# Altium project piezocontroller.PrjPCB
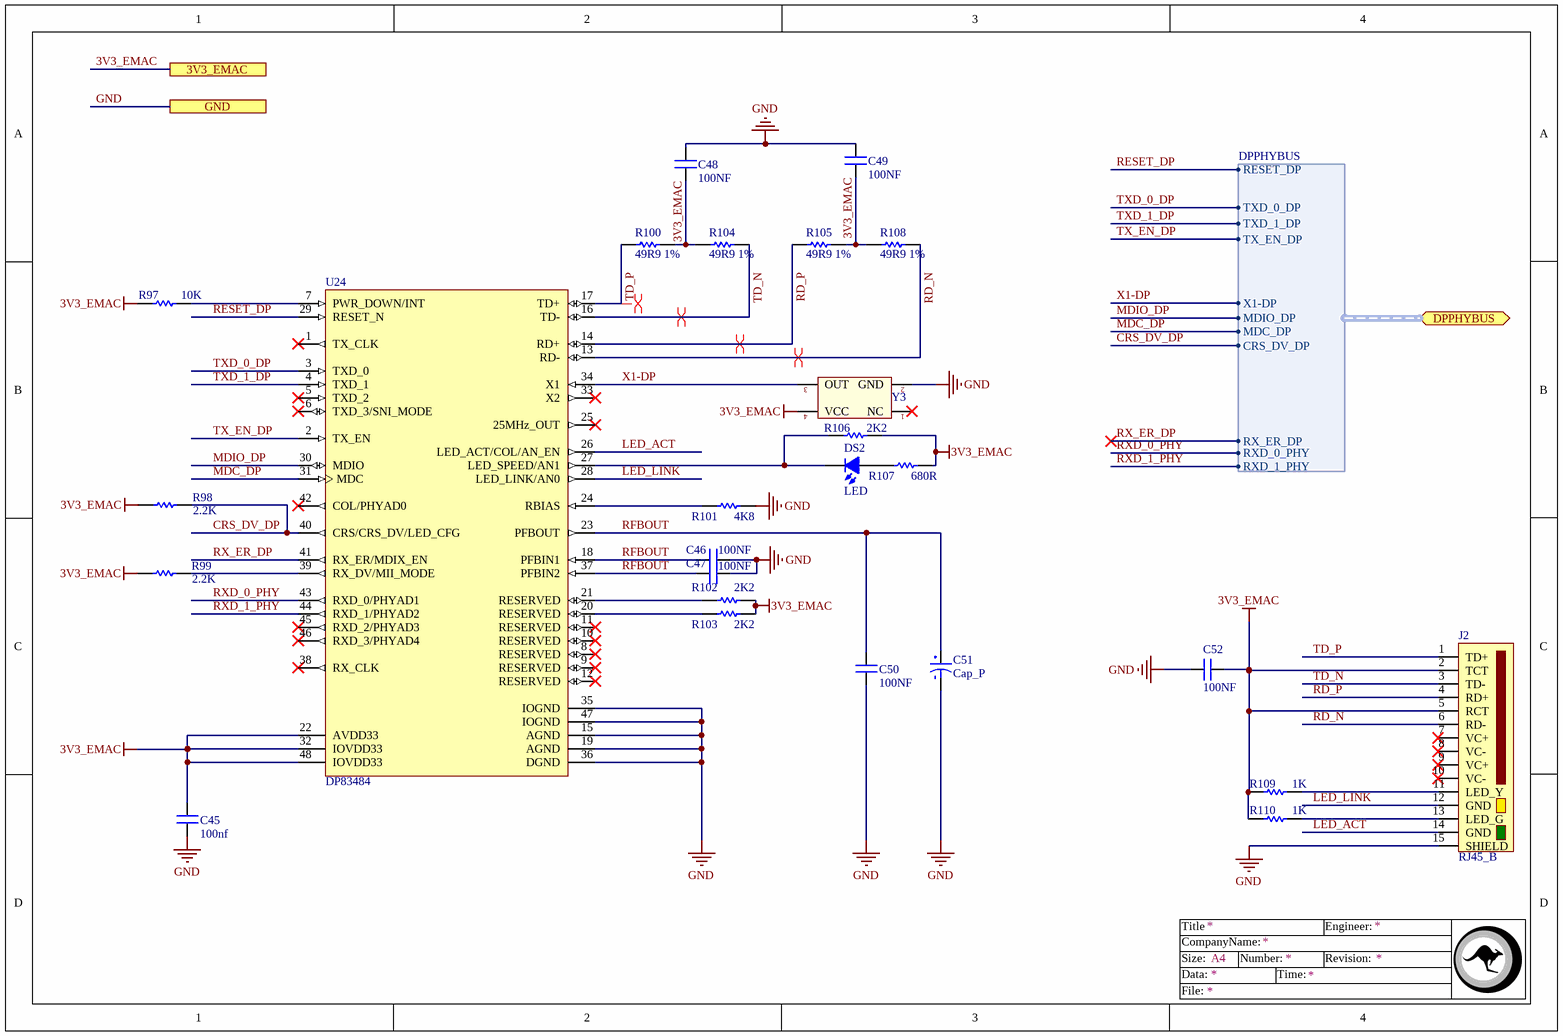
[diagram p0: Communication Ethernet DP.SchDoc]
5 sheets, 259 parts. Net scope: flat (ports and power ports of the same name join across sheets).
Board file: piezocontroller.PcbDoc
Sheets:
  Communication Ethernet DP.SchDoc
  Analogue.SchDoc
  Communication USB - FT232.SchDoc
  Power Management.SchDoc
  MicroControllerSTM32f107VCT.SchDoc

## Sheet Communication Ethernet DP.SchDoc
size A4

### Parts
C45  100nf  [Cap0805]
C46  100NF  [Cap0805]
C47  100NF  [Cap0805]
C48  100NF  [Cap0805]
C49  100NF  [Cap0805]
C50  100NF  [Cap0805]
C51  Cap_P  [Cap_4mm]
C52  100NF  [Cap0805]
DS2  LED  [Led0805]
J2  RJ45_B  [RJ45_B]
R97  10K  [R0805]
R98  2.2K  [R0805]
R99  2.2K  [R0805]
R100  49R9 1%  [R0805]
R101  4K8  [R0805]
R102  2K2  [R0805]
R103  2K2  [R0805]
R104  49R9 1%  [R0805]
R105  49R9 1%  [R0805]
R106  2K2  [R0805]
R107  680R  [R0805]
R108  49R9 1%  [R0805]
R109  1K  [R0805]
R110  1K  [R0805]
U24  DP83484  [DP83484]
Y3  Oscillator  [Crystall 50Mhz]  (value not drawn)

### Ports
3V3_EMAC, DPPHYBUS (bidir, harness DPPHYBUS), GND

### Harnesses
DPPHYBUS: RESET_DP, TXD_0_DP, X1-DP, TXD_1_DP, TX_EN_DP, MDIO_DP, MDC_DP, CRS_DV_DP, RX_ER_DP, RXD_0_PHY, RXD_1_PHY

### Nets
3V3_EMAC: C45.2 C48.1 C49.1 C52.1 J2.2(TCT) J2.5(RCT) R97.2 R98.2 R99.2 R100.2 R102.1 R103.1 R104.1 R105.2 R106.1 R107.1 R108.1 R109.1 R110.1 U24.22(AVDD33) U24.32(IOVDD33) U24.48(IOVDD33) Y3.4(VCC) ; port 3V3_EMAC
GND: C45.1 C46.2 C47.2 C48.2 C49.2 C50.1 C51.1 C52.2 J2.15(SHIELD) R101.1 U24.15(AGND) U24.19(AGND) U24.35(IOGND) U24.36(DGND) U24.47(IOGND) Y3.2(GND) ; port GND  [project net -12VD]
CRS_DV_DP: R98.1 U24.40(CRS/CRS_DV/LED_CFG) ; port DPPHYBUS.CRS_DV_DP
LED_ACT: J2.14(GND) U24.26(LED_ACT/COL/AN_EN)
LED_LINK: J2.12(GND) U24.28(LED_LINK/AN0)
MDC_DP: U24.31(MDC) ; port DPPHYBUS.MDC_DP  [project net ETH-MDC]
MDIO_DP: U24.30(MDIO) ; port DPPHYBUS.MDIO_DP  [project net ETH-MDIO]
RD_N: J2.6(RD-) R108.2 U24.13(RD-)
RD_P: J2.4(RD+) R105.1 U24.14(RD+)
RESET_DP: U24.29(RESET_N) ; port DPPHYBUS.RESET_DP  [project net NRST]
RFBOUT: C46.1 C47.1 C50.2 C51.2 U24.18(PFBIN1) U24.23(PFBOUT) U24.37(PFBIN2)
RX_ER_DP: U24.41(RX_ER/MDIX_EN) ; port DPPHYBUS.RX_ER_DP
RXD_0_PHY: U24.43(RXD_0/PHYAD1) ; port DPPHYBUS.RXD_0_PHY  [project net ETH-RXD0]
RXD_1_PHY: U24.44(RXD_1/PHYAD2) ; port DPPHYBUS.RXD_1_PHY  [project net ETH-RXD1]
TD_N: J2.3(TD-) R104.2 U24.16(TD-)
TD_P: J2.1(TD+) R100.1 U24.17(TD+)
TX_EN_DP: U24.2(TX_EN) ; port DPPHYBUS.TX_EN_DP  [project net ETH-TX-EN]
TXD_0_DP: U24.3(TXD_0) ; port DPPHYBUS.TXD_0_DP  [project net ETH-TXD0]
TXD_1_DP: U24.4(TXD_1) ; port DPPHYBUS.TXD_1_DP  [project net ETH-TXD1]
X1-DP: U24.34(X1) Y3.3(OUT) ; port DPPHYBUS.X1-DP  [project net ETH-REF-CLK]
NetDS2_A: DS2.A R107.2
NetDS2_K: DS2.K R106.2 U24.27(LED_SPEED/AN1)
NetJ2_11: J2.11(LED_Y) R109.2
NetJ2_13: J2.13(LED_G) R110.2
NetR97_1: R97.1 U24.7(PWR_DOWN/INT)
NetR99_1: R99.1 U24.39(RX_DV/MII_MODE)
NetR101_2: R101.2 U24.24(RBIAS)
NetR102_2: R102.2 U24.21(RESERVED)
NetR103_2: R103.2 U24.20(RESERVED)

Not connected (* = marked no-connect by the designer): J2 7(VC+)* 8(VC-)* 9(VC+)* 10(VC-)*; U24 1(TX_CLK)* 5(TXD_2)* 6(TXD_3/SNI_MODE)* 8(RESERVED)* 9(RESERVED)* 10(RESERVED)* 11(RESERVED)* 12(RESERVED)* 25(25MHz_OUT)* 33(X2)* 38(RX_CLK)* 42(COL/PHYAD0)* 45(RXD_2/PHYAD3)* 46(RXD_3/PHYAD4)*; Y3 1(NC)*

### Layout directives
differential pair: RD_N, RD_P, TD_N, TD_P

### Notes on the sheet
- Title
- Size:
- Data:
- CompanyName:
- A4
- Number:
- Time:
- Revision:
- Engineer:
- File:

### Library data of the parts
C45-C50 C52 = Cap: Surface mount Capacitor
C51 = Cap_P: Polarity
J2 = RJ45_B: Ethernet Connector
R97-R110 = Resistor
U24 = DP83484: Ethernet PHY

## Sheet Analogue.SchDoc
size A3
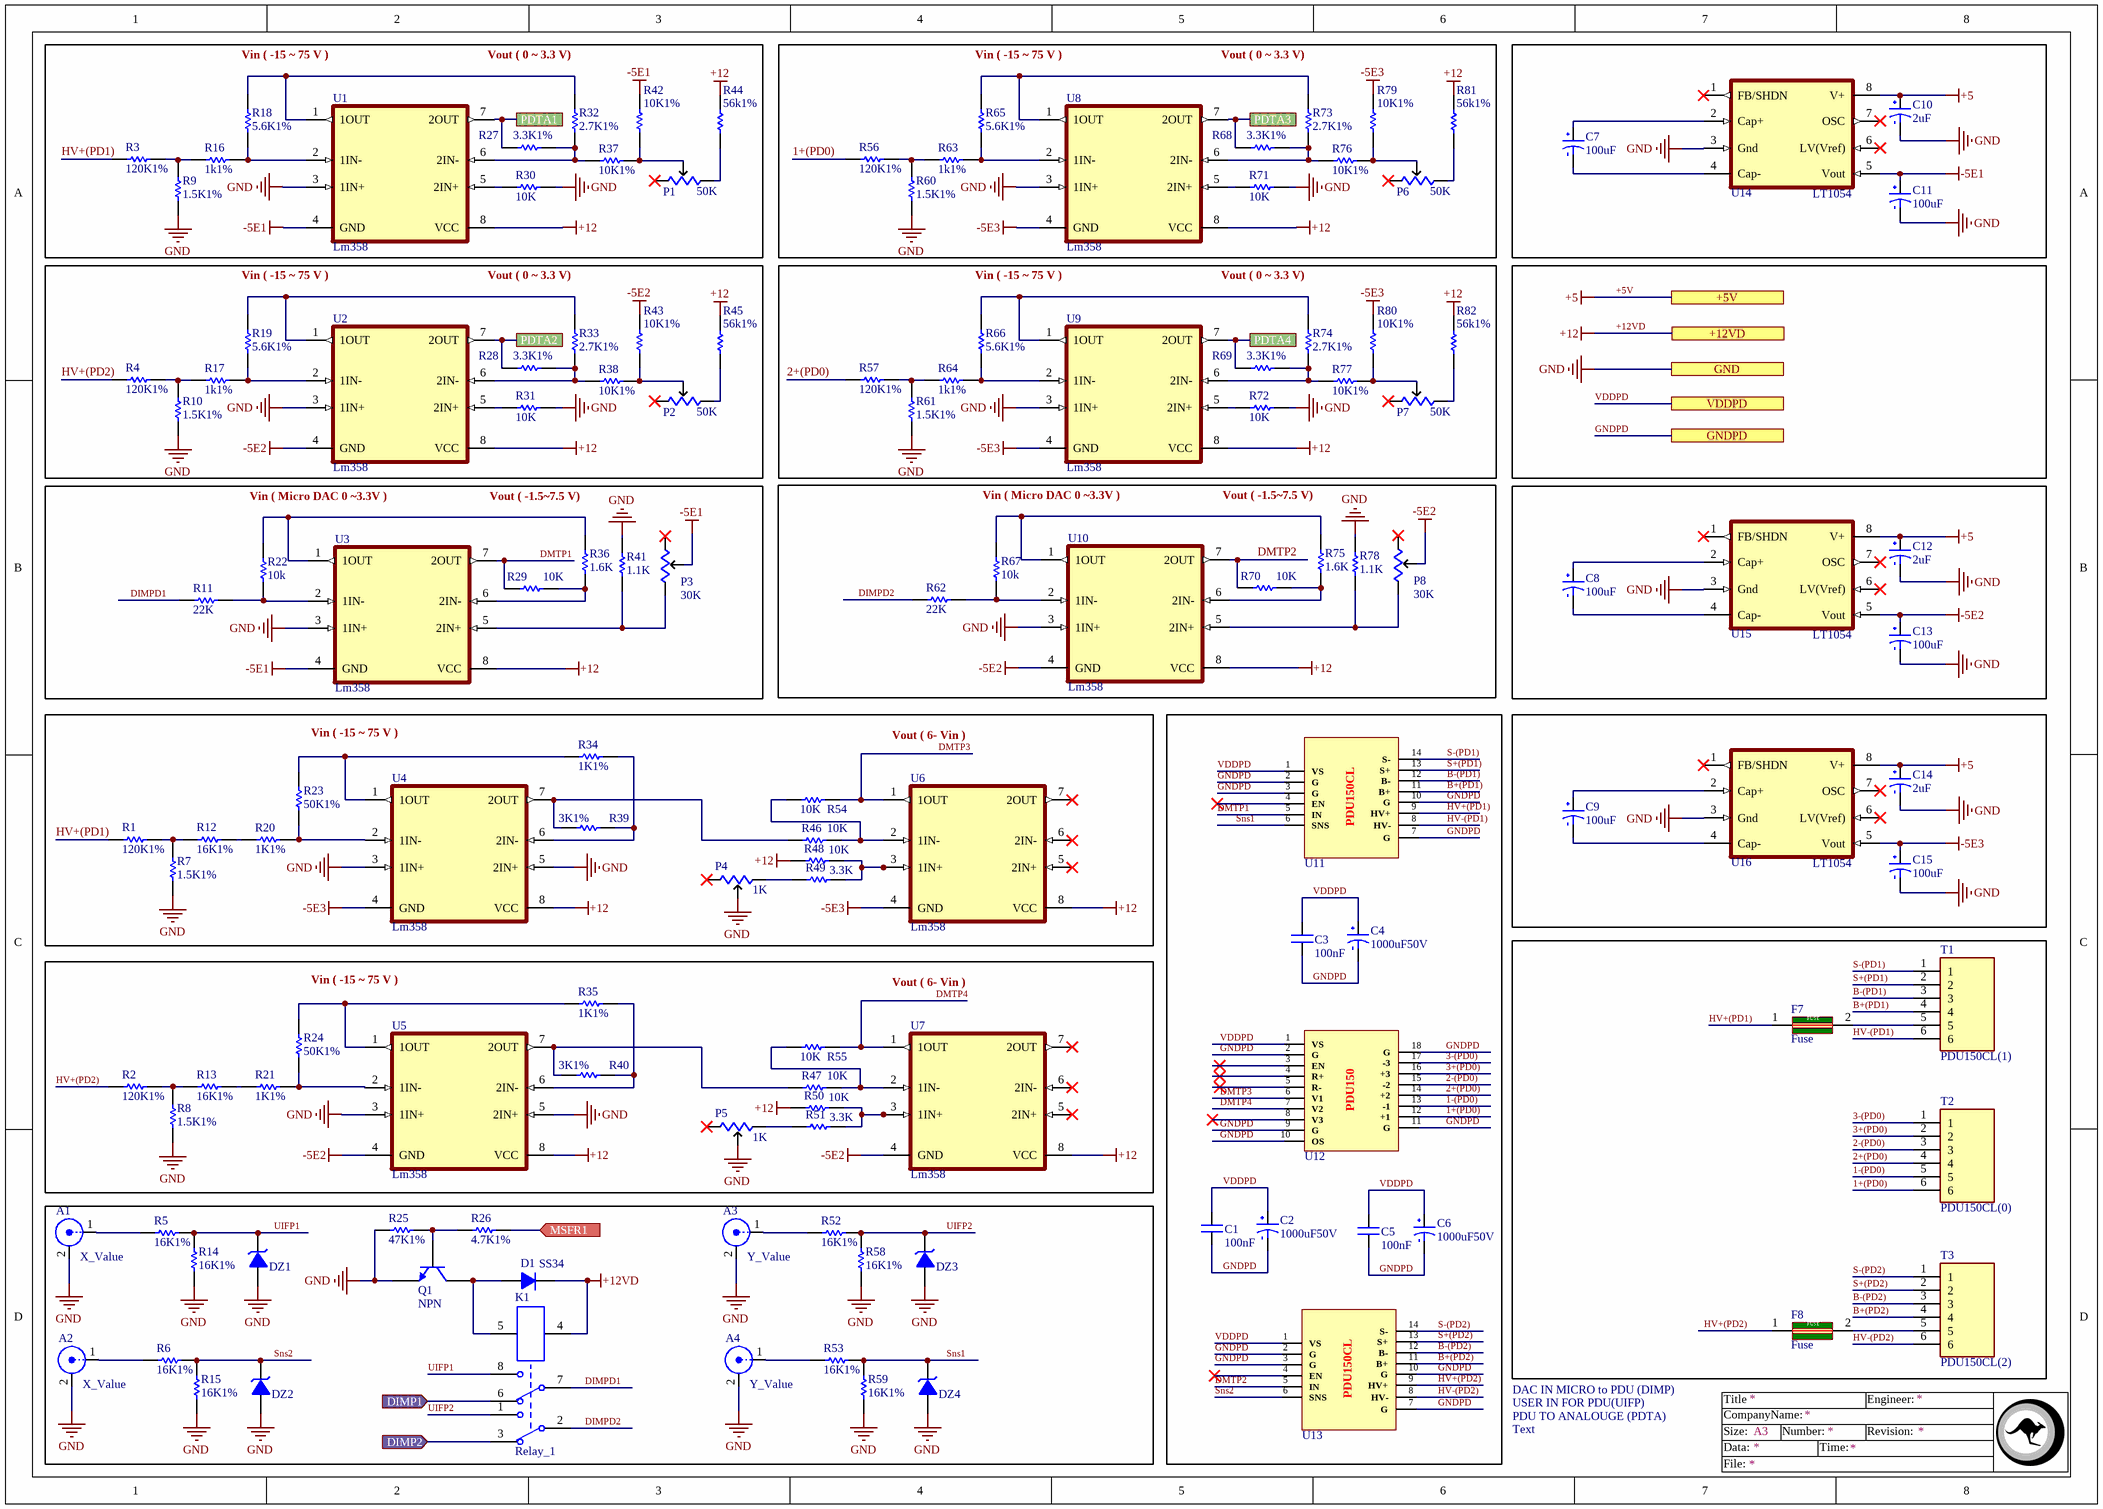
[diagram p1: Analogue.SchDoc]

### Parts
A1  X_Value  [SMA - R]
A2  X_Value  [SMA - R]
A3  Y_Value  [SMA - R]
A4  Y_Value  [SMA - R]
C1  100nF  [Cap0805]
C2  1000uF50V  [Cap_5mm]
C3  100nF  [Cap0805]
C4  1000uF50V  [Cap_5mm]
C5  100nF  [Cap0805]
C6  1000uF50V  [Cap_5mm]
C7  100uF  [CAPMOL_D]
C8  100uF  [CAPMOL_D]
C9  100uF  [CAPMOL_D]
C10  2uF  [CAPMOL_B]
C11  100uF  [CAPMOL_D]
C12  2uF  [CAPMOL_B]
C13  100uF  [CAPMOL_D]
C14  2uF  [CAPMOL_B]
C15  100uF  [CAPMOL_D]
D1  SS34  [Diod-1A-SMD]
DZ1  Diode Zener  [LL4148]  (value not drawn)
DZ2  Diode Zener  [LL4148]  (value not drawn)
DZ3  Diode Zener  [LL4148]  (value not drawn)
DZ4  Diode Zener  [LL4148]  (value not drawn)
F7  Fuse  [1206]
F8  Fuse  [1206]
K1  Relay_1  [Relay_1]
P1  50K  [Multi_tern]
P2  50K  [Multi_tern]
P3  30K  [Multi_tern]
P4  1K  [Multi_tern]
P5  1K  [Multi_tern]
P6  50K  [Multi_tern]
P7  50K  [Multi_tern]
P8  30K  [Multi_tern]
Q1  NPN  [SOT23_BEC_N]
R1  120K1%  [R0805]
R2  120K1%  [R0805]
R3  120K1%  [R0805]
R4  120K1%  [R0805]
R5  16K1%  [R0805]
R6  16K1%  [R0805]
R7  1.5K1%  [R0805]
R8  1.5K1%  [R0805]
R9  1.5K1%  [R0805]
R10  1.5K1%  [R0805]
R11  22K  [R0805]
R12  16K1%  [R0805]
R13  16K1%  [R0805]
R14  16K1%  [R0805]
R15  16K1%  [R0805]
R16  1k1%  [R0805]
R17  1k1%  [R0805]
R18  5.6K1%  [R0805]
R19  5.6K1%  [R0805]
R20  1K1%  [R0805]
R21  1K1%  [R0805]
R22  10k  [R0805]
R23  50K1%  [R0805]
R24  50K1%  [R0805]
R25  47K1%  [R0805]
R26  4.7K1%  [R0805]
R27  3.3K1%  [R0805]
R28  3.3K1%  [R0805]
R29  10K  [R0805]
R30  10K  [R0805]
R31  10K  [R0805]
R32  2.7K1%  [R0805]
R33  2.7K1%  [R0805]
R34  1K1%  [R0805]
R35  1K1%  [R0805]
R36  1.6K  [R0805]
R37  10K1%  [R0805]
R38  10K1%  [R0805]
R39  3K1%  [R0805]
R40  3K1%  [R0805]
R41  1.1K  [R0805]
R42  10K1%  [R0805]
R43  10K1%  [R0805]
R44  56k1%  [R0805]
R45  56k1%  [R0805]
R46  10K  [R0805]
R47  10K  [R0805]
R48  10K  [R0805]
R49  3.3K  [R0805]
R50  10K  [R0805]
R51  3.3K  [R0805]
R52  16K1%  [R0805]
R53  16K1%  [R0805]
R54  10K  [R0805]
R55  10K  [R0805]
R56  120K1%  [R0805]
R57  120K1%  [R0805]
R58  16K1%  [R0805]
R59  16K1%  [R0805]
R60  1.5K1%  [R0805]
R61  1.5K1%  [R0805]
R62  22K  [R0805]
R63  1k1%  [R0805]
R64  1k1%  [R0805]
R65  5.6K1%  [R0805]
R66  5.6K1%  [R0805]
R67  10k  [R0805]
R68  3.3K1%  [R0805]
R69  3.3K1%  [R0805]
R70  10K  [R0805]
R71  10K  [R0805]
R72  10K  [R0805]
R73  2.7K1%  [R0805]
R74  2.7K1%  [R0805]
R75  1.6K  [R0805]
R76  10K1%  [R0805]
R77  10K1%  [R0805]
R78  1.1K  [R0805]
R79  10K1%  [R0805]
R80  10K1%  [R0805]
R81  56k1%  [R0805]
R82  56k1%  [R0805]
T1  PDU150CL(1)  [SPOX6]
T2  PDU150CL(0)  [SPOX6]
T3  PDU150CL(2)  [SPOX6]
U1  Lm358  [SOIC127P600X175-8N]
U2  Lm358  [SOIC127P600X175-8N]
U3  Lm358  [SOIC127P600X175-8N]
U4  Lm358  [SOIC127P600X175-8N]
U5  Lm358  [SOIC127P600X175-8N]
U6  Lm358  [SOIC127P600X175-8N]
U7  Lm358  [SOIC127P600X175-8N]
U8  Lm358  [SOIC127P600X175-8N]
U9  Lm358  [SOIC127P600X175-8N]
U10  Lm358  [SOIC127P600X175-8N]
U11  PDU150CL  [PDU150CL]  (value not drawn)
U12  PDU150  [PDU150]  (value not drawn)
U13  PDU150CL  [PDU150CL]  (value not drawn)
U14  LT1054  [SOIC127P600X175-8N]
U15  LT1054  [SOIC127P600X175-8N]
U16  LT1054  [SOIC127P600X175-8N]

### Ports
+5V, +12VD, DIMP1 (in), DIMP2 (in), GND, GNDPD, MSFR1 (in), PDTA1, PDTA2, PDTA3, PDTA4, VDDPD

### Nets
+5V: C10.2 C12.2 C14.2 U14.8(V+) U15.8(V+) U16.8(V+) ; port +5V  [also labelled +5]
+12: D1.K K1.4 R44.1 R45.1 R48.1 R50.1 R81.1 R82.1 U1.8(VCC) U2.8(VCC) U3.8(VCC) U4.8(VCC) U5.8(VCC) U6.8(VCC) U7.8(VCC) U8.8(VCC) U9.8(VCC) U10.8(VCC) ; port +12VD  [also labelled +12VD]  [project net +12V]
-5E1: C11.2 P3.2 R42.1 U1.4(GND) U3.4(GND) U14.5(Vout)
-5E2: C13.2 P8.2 R43.1 U2.4(GND) U5.4(GND) U7.4(GND) U10.4(GND) U15.5(Vout)
-5E3: C15.2 R79.1 R80.1 U4.4(GND) U6.4(GND) U8.4(GND) U9.4(GND) U16.5(Vout)
GND: A1.2(Y) A2.2(Y) A3.2(Y) A4.2(Y) C10.1 C11.1 C12.1 C13.1 C14.1 C15.1 DZ1.A DZ2.A DZ3.A DZ4.A P4.2 P5.2 Q1.2(E) R7.1 R8.1 R9.1 R10.1 R14.1 R15.1 R25.2 R30.1 R31.1 R41.1 R58.1 R59.1 R60.1 R61.1 R71.1 R72.1 R78.1 U1.3(1IN+) U2.3(1IN+) U3.3(1IN+) U4.3(1IN+) U4.5(2IN+) U5.3(1IN+) U5.5(2IN+) U8.3(1IN+) U9.3(1IN+) U10.3(1IN+) U14.3(Gnd) U15.3(Gnd) U16.3(Gnd) ; port GND  [project net -12VD]
1+(PD0): R56.2 T2.6 U12.12(+1)
1-(PD0): T2.5 U12.13(-1)
2+(PD0): R57.2 T2.4 U12.14(+2)
2-(PD0): T2.3 U12.15(-2)
3+(PD0): T2.2 U12.16(+3)
3-(PD0): T2.1 U12.17(-3)
B+(PD1): T1.4 U11.11(B+)
B+(PD2): T3.4 U13.11(B+)
B-(PD1): T1.3 U11.12(B-)
B-(PD2): T3.3 U13.12(B-)
DIMPD1: K1.7 R11.1
DIMPD2: K1.2 R62.1
DMTP1: R29.1 U3.7(2OUT) U11.5(IN)
DMTP2: R70.1 U10.7(2OUT) U13.5(IN)
DMTP3: R54.2 U6.1(1OUT) U12.6(V1)
DMTP4: R55.2 U7.1(1OUT) U12.7(V2)
GNDPD: C1.1 C2.1 C3.1 C4.1 C5.1 C6.1 U11.2(G) U11.3(G) U11.7(G) U11.10(G) U12.2(G) U12.9(G) U12.10(OS) U12.11(G) U12.18(G) U13.2(G) U13.3(G) U13.7(G) U13.10(G) ; port GNDPD
HV+(PD1): F7.1(IN) R1.1 R3.2 U11.9(HV+)
HV+(PD2): F8.1(IN) R2.1 R4.2 U13.9(HV+)
HV-(PD1): T1.6 U11.8(HV-)
HV-(PD2): T3.6 U13.8(HV-)
S+(PD1): T1.2 U11.13(S+)
S+(PD2): T3.2 U13.13(S+)
S-(PD1): T1.1 U11.14(S-)
S-(PD2): T3.1 U13.14(S-)
Sns1: DZ4.K R53.2 R59.2 U11.6(SNS)
Sns2: DZ2.K R6.2 R15.2 U13.6(SNS)
UIFP1: DZ1.K K1.8 R5.2 R14.2
UIFP2: DZ3.K K1.1 R52.2 R58.2
VDDPD: C1.2 C2.2 C3.2 C4.2 C5.2 C6.2 U11.1(VS) U12.1(VS) U13.1(VS) ; port VDDPD
NetA1_1: A1.1(X) R5.1
NetA2_1: A2.1(X) R6.1
NetA3_1: A3.1(X) R52.1
NetA4_1: A4.1(X) R53.1
NetC7_1: C7.1 U14.4(Cap-)
NetC7_2: C7.2 U14.2(Cap+)
NetC8_1: C8.1 U15.4(Cap-)
NetC8_2: C8.2 U15.2(Cap+)
NetC9_1: C9.1 U16.4(Cap-)
NetC9_2: C9.2 U16.2(Cap+)
NetD1_A: D1.A K1.5 Q1.3(C)
NetF7_2: F7.2(OUT) T1.5
NetF8_2: F8.2(OUT) T3.5
NetK1_3: K1.3 ; port DIMP2
NetK1_6: K1.6 ; port DIMP1
NetP1_2: P1.2 R37.1 R42.2
NetP1_3: P1.3 R44.2
NetP2_2: P2.2 R38.1 R43.2
NetP2_3: P2.3 R45.2
NetP3_3: P3.3 R41.2 U3.5(2IN+)
NetP4_1: P4.1 R49.1
NetP5_1: P5.1 R51.1
NetP6_2: P6.2 R76.1 R79.2
NetP6_3: P6.3 R81.2
NetP7_2: P7.2 R77.1 R80.2
NetP7_3: P7.3 R82.2
NetP8_3: P8.3 R78.2 U10.5(2IN+)
NetQ1_1: Q1.1(B) R25.1 R26.2
NetR1_2: R1.2 R7.2 R12.1
NetR2_2: R2.2 R8.2 R13.1
NetR3_1: R3.1 R9.2 R16.1
NetR4_1: R4.1 R10.2 R17.1
NetR11_2: R11.2 R22.2 U3.2(1IN-)
NetR12_2: R12.2 R20.1
NetR13_2: R13.2 R21.1
NetR16_2: R16.2 R18.2 U1.2(1IN-)
NetR17_2: R17.2 R19.2 U2.2(1IN-)
NetR18_1: R18.1 R32.1 U1.1(1OUT)
NetR19_1: R19.1 R33.1 U2.1(1OUT)
NetR20_2: R20.2 R23.2 U4.2(1IN-)
NetR21_2: R21.2 R24.2 U5.2(1IN-)
NetR22_1: R22.1 R36.1 U3.1(1OUT)
NetR23_1: R23.1 R34.1 U4.1(1OUT)
NetR24_1: R24.1 R35.1 U5.1(1OUT)
NetR26_1: R26.1 ; port MSFR1
NetR27_1: R27.1 U1.7(2OUT) ; port PDTA1
NetR27_2: R27.2 R32.2 R37.2 U1.6(2IN-)
NetR28_1: R28.1 U2.7(2OUT) ; port PDTA2
NetR28_2: R28.2 R33.2 R38.2 U2.6(2IN-)
NetR29_2: R29.2 R36.2 U3.6(2IN-)
NetR30_2: R30.2 U1.5(2IN+)
NetR31_2: R31.2 U2.5(2IN+)
NetR34_2: R34.2 R39.2 U4.6(2IN-)
NetR35_2: R35.2 R40.2 U5.6(2IN-)
NetR39_1: R39.1 R46.1 U4.7(2OUT)
NetR40_1: R40.1 R47.1 U5.7(2OUT)
NetR46_2: R46.2 R54.1 U6.2(1IN-)
NetR47_2: R47.2 R55.1 U7.2(1IN-)
NetR48_2: R48.2 R49.2 U6.3(1IN+)
NetR50_2: R50.2 R51.2 U7.3(1IN+)
NetR56_1: R56.1 R60.2 R63.1
NetR57_1: R57.1 R61.2 R64.1
NetR62_2: R62.2 R67.2 U10.2(1IN-)
NetR63_2: R63.2 R65.2 U8.2(1IN-)
NetR64_2: R64.2 R66.2 U9.2(1IN-)
NetR65_1: R65.1 R73.1 U8.1(1OUT)
NetR66_1: R66.1 R74.1 U9.1(1OUT)
NetR67_1: R67.1 R75.1 U10.1(1OUT)
NetR68_1: R68.1 U8.7(2OUT) ; port PDTA3
NetR68_2: R68.2 R73.2 R76.2 U8.6(2IN-)
NetR69_1: R69.1 U9.7(2OUT) ; port PDTA4
NetR69_2: R69.2 R74.2 R77.2 U9.6(2IN-)
NetR70_2: R70.2 R75.2 U10.6(2IN-)
NetR71_2: R71.2 U8.5(2IN+)
NetR72_2: R72.2 U9.5(2IN+)

Not connected (* = marked no-connect by the designer): P1 1*; P2 1*; P3 1*; P4 3*; P5 3*; P6 1*; P7 1*; P8 1*; U6 5(2IN+)* 6(2IN-)* 7(2OUT)*; U7 5(2IN+)* 6(2IN-)* 7(2OUT)*; U11 4(EN)*; U12 3(EN)* 4(R+)* 5(R-)* 8(V3)*; U13 4(EN)*; U14 1(FB/SHDN)* 6(LV(Vref))* 7(OSC)*; U15 1(FB/SHDN)* 6(LV(Vref))* 7(OSC)*; U16 1(FB/SHDN)* 6(LV(Vref))* 7(OSC)*

### Notes on the sheet
- Vin ( -15 ~ 75 V )
- Vout ( 0 ~ 3.3 V)
- Vin ( Micro DAC 0 ~3.3V )
- Vout ( -1.5~7.5 V)
- Vout ( 6- Vin )
- DAC IN MICRO to PDU (DIMP)
- USER IN FOR PDU(UIFP)
- PDU TO ANALOUGE (PDTA)
- Text
- Title
- Size:
- Data:
- CompanyName:
- A3
- Number:
- Time:
- Revision:
- Engineer:
- File:
- (in symbol Fuse) FUSE

### Library data of the parts
A1-A4 = ANTENA: Antena MLF
C1 C3 C5 = Cap: Surface mount Capacitor
C2 C4 C6-C15 = Cap_P: Polarity
D1 = Diode
K1 = Relay_1: Relay
P1-P8 = POT: Potentiometer
Q1 = NPN: NPN Bipolar Transistor; Published: 8-Jun-2000; LatestRevisionDate: 29-May-2009; LatestRevisionNote: IPC-7351 Footprint Added.; PackageVersion: Aug-1999; PackageReference: SOT-23B; Publisher: Altium Limited; PackageDescription: 3-Pin SOT-23 Package 0.95 mm Pitch, 2.4 mm Lead Span
R1-R17 R20 R21 R25 R26 R52 R53 R56-R64 = Resistor: 30K
R18 R19 R22-R24 R27-R51 R54 R55 R65-R82 = Resistor
T1-T3 = SPOX 1*6
U14-U16 = LMC7660

## Sheet Communication USB - FT232.SchDoc
size A4
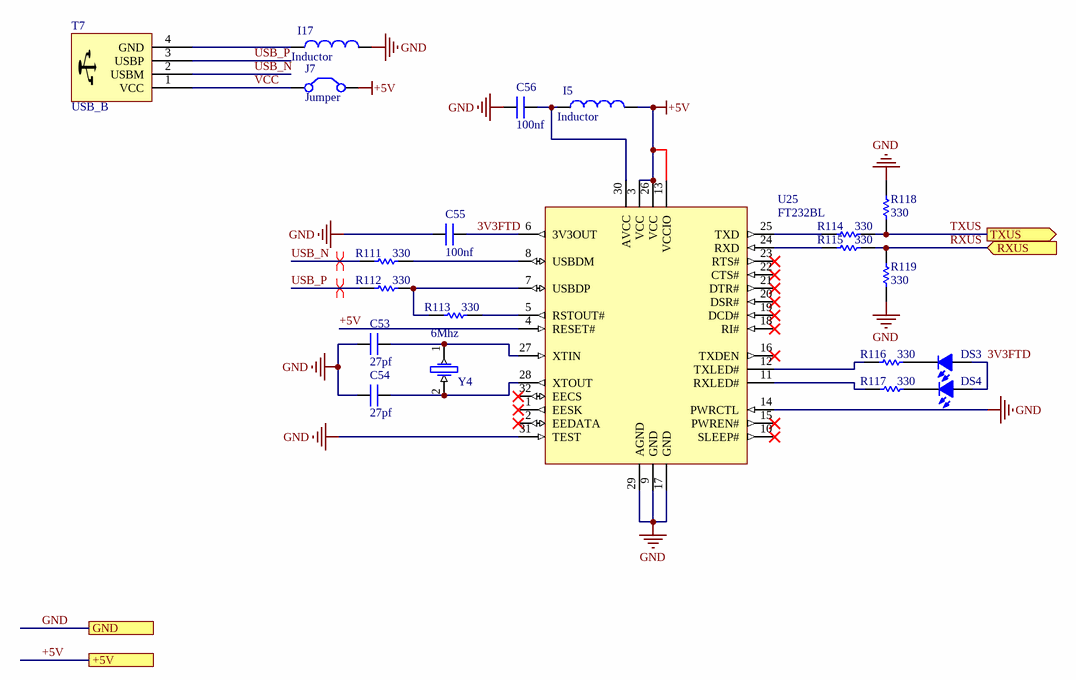
[diagram p2: Communication USB - FT232.SchDoc]

### Parts
C53  27pf  [Cap0805]
C54  27pf  [Cap0805]
C55  100nf  [Cap0805]
C56  100nf  [Cap0805]
DS3  LED  [Led0805]  (value not drawn)
DS4  LED  [Led0805]  (value not drawn)
I5  Inductor  [1206]
I17  Inductor  [1206]
J7  Jumper  [Jumper]
R111  330  [R0805]
R112  330  [R0805]
R113  330  [R0805]
R114  330  [R0805]
R115  330  [R0805]
R116  330  [R0805]
R117  330  [R0805]
R118  330  [R0805]
R119  330  [R0805]
T7  USB_B  [USB_Dip_R]
U25  FT232BL  [LQFP-32_L]
Y4  6Mhz  [CrystallB]

### Ports
+5V, GND, RXUS (in), TXUS (out)

### Nets
+5V: I5.2 J7.2(C2) U25.3(VCC) U25.4(RESET#) U25.13(VCCIO) U25.26(VCC) ; port +5V
GND: C53.1 C54.1 C55.2 C56.2 I17.2 R118.2 R119.1 U25.9(GND) U25.14(PWRCTL) U25.17(GND) U25.29(AGND) U25.31(TEST) ; port GND  [project net -12VD]
3V3FTD: C55.1 DS3.A DS4.A U25.6(3V3OUT)
RXUS: R115.2 R119.2 ; port RXUS
TXUS: R114.2 R118.1 ; port TXUS
USB_N: R111.1 T7.2(USBM)
USB_P: R112.1 T7.3(USBP)
VCC: J7.1(C1) T7.1(VCC)
NetC53_2: C53.2 U25.27(XTIN) Y4.1
NetC54_2: C54.2 U25.28(XTOUT) Y4.2
NetC56_1: C56.1 I5.1 U25.30(AVCC)
NetDS3_K: DS3.K R116.2
NetDS4_K: DS4.K R117.2
NetI17_1: I17.1 T7.4(GND)
NetR111_2: R111.2 U25.8(USBDM)
NetR112_2: R112.2 R113.1 U25.7(USBDP)
NetR113_2: R113.2 U25.5(RSTOUT#)
NetR114_1: R114.1 U25.25(TXD)
NetR115_1: R115.1 U25.24(RXD)
NetR116_1: R116.1 U25.12(TXLED#)
NetR117_1: R117.1 U25.11(RXLED#)

Not connected (* = marked no-connect by the designer): U25 1(EESK)* 2(EEDATA)* 10(SLEEP#)* 15(PWREN#)* 16(TXDEN)* 18(RI#)* 19(DCD#)* 20(DSR#)* 21(DTR#)* 22(CTS#)* 23(RTS#)* 32(EECS)*

### Layout directives
differential pair: USB_N, USB_P

### Notes on the sheet
- Title
- Size:
- Data:
- CompanyName:
- A4
- Number:
- Time:
- Revision:
- Engineer:
- File:

### Library data of the parts
C53-C56 = Cap: Surface mount Capacitor
I5 I17 = Inductor: Indicator
R111-R119 = Resistor
T7 = USB_B: USB B Connector
U25 = FT232BL: USB UART Asynchronous Serial Data Transfer Chip, LQFP-32, Pb-Free; DatasheetVersion: ver 2.2, Nov-2011; PackageVersion: 2010; PackageReference: LQFP-32; PackageDescription: 32-Pin Thin Quad Flat Pack 0.8 mm Pitch; ComponentLink1Description: Manufacturer URL; ComponentLink1URL: http://www.ftdichip.com/; ComponentLink2Description: Datasheet; ComponentLink2URL: http://www.ftdichip.com/Support/Documents/DataSheets/ICs/DS_FT232BL_BQ.pdf
Y4 = Crystal

## Sheet Power Management.SchDoc
size A4
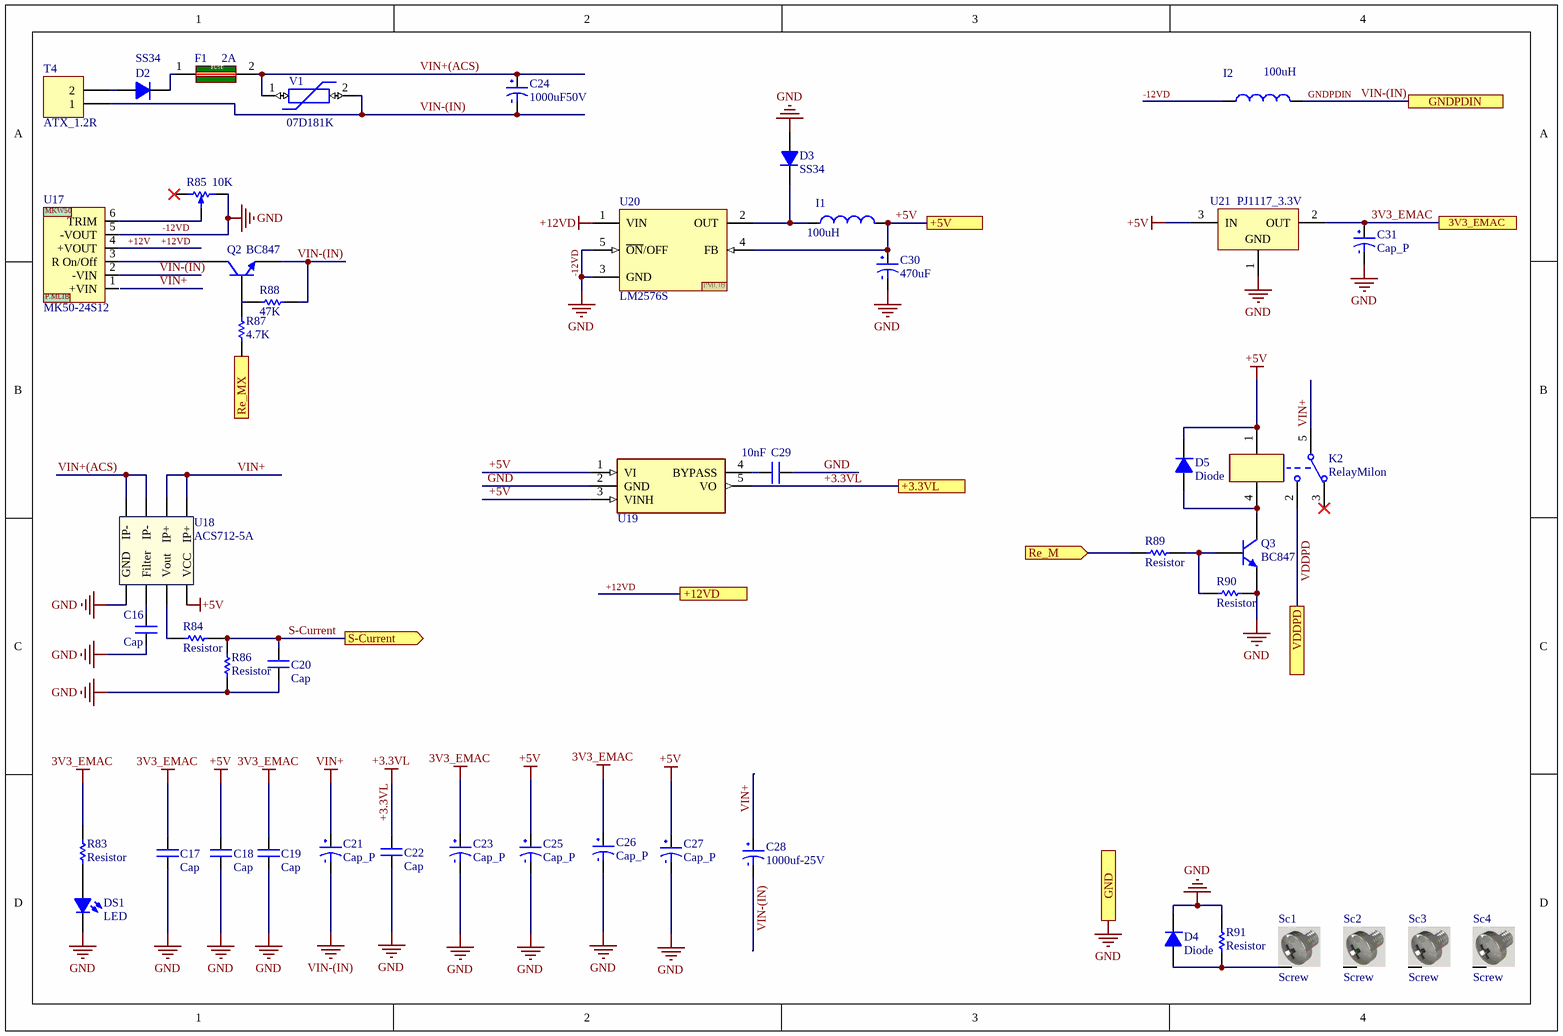
[diagram p3: Power Management.SchDoc]

### Parts
C16  Cap  [Cap0805]
C17  Cap  [Cap0805]
C18  Cap  [Cap0805]
C19  Cap  [Cap0805]
C20  Cap  [Cap0805]
C21  Cap_P  [Cap_5mm]
C22  Cap  [Cap0805]
C23  Cap_P  [CAPMOL_C]
C24  1000uF50V  [Cap_8mm]
C25  Cap_P  [CAPMOL_C]
C26  Cap_P  [CAPMOL_C]
C27  Cap_P  [Cap_SMD]
C28  1000uf-25V  [Cap_5mm]
C29  10nF  [Cap0805]
C30  470uF  [Cap_4mm]
C31  Cap_P  [Cap_4mm]
D2  SS34  [Diod-1A-SMD]
D3  SS34  [Diod-1A-SMD]
D4  Diode  [Diod-1A-SMD]
D5  Diode  [Diod-1A-SMD]
DS1  LED  [Led0805]
F1  2A  [1206]
I1  100uH  [Indicator_SMD]
I2  100uH  [Indicator_10mH]
K2  RelayMilon  [RelayMinionSmall]
Q2  BC847  [SOT23_BEC_L]
Q3  BC847  [SOT23_BEC_L]
R83  Resistor  [R0805]
R84  Resistor  [R0805]
R85  value 10K  [POT4MM-Small Pot]  (hidden comment: RPot SM)
R86  Resistor  [R0805]
R87  4.7K  [R0805]
R88  47K  [R0805]
R89  Resistor  [R0805]
R90  Resistor  [R0805]
R91  Resistor  [0603]
Sc1  Screw  [Screw]
Sc2  Screw  [Screw]
Sc3  Screw  [Screw]
Sc4  Screw  [Screw]
T4  ATX_1.2R  [ATX_1.2S]
U17  MK50-24S12  [MK50]
U18  ACS712-5A  [SOP8]
U19  LD3985M33R  [SOT95P280X110-5N]  (value not drawn)
U20  LM2576S  [LM2576S]
U21  PJ1117_3.3V  [PJ1117s]
V1  07D181K  [MOV-7D]

### Ports
3V3_EMAC, +3.3VL, +5V, +12VD, GND, GNDPDIN, Re_M (in), Re_MX (in), S-Current (out), VDDPD

### Nets
3V3_EMAC: C17.2 C19.2 C23.2 C26.2 C31.2 R83.1 U21.2(OUT) ; port 3V3_EMAC
+3.3VL: C22.2 U19.5(VO) ; port +3.3VL
+5V: C18.2 C25.2 C27.2 C30.2 D5.K I1.2 K2.1 U18.8(VCC) U19.1(VI) U19.3(VINH) U20.4(FB) U21.3(IN) ; port +5V
+12V: U17.4(+VOUT) U20.1(VIN) ; port +12VD  [also labelled +12VD]
-12VD: C16.1 C17.1 C18.1 C19.1 C20.1 C22.1 C23.1 C25.1 C26.1 C27.1 C29.2 C30.1 C31.1 D3.A D4.K DS1.K I2.1 Q3.2(E) R85.CW(+) R86.2 R90.1 R91.1 U17.5(-VOUT) U18.5(GND) U19.2(GND) U20.3(GND) U20.5(~{ON}/OFF) U21.1(GND) ; port GND  [also labelled GND]
GNDPDIN: C21.1 C24.1 C28.1 I2.2 Q2.2(E) R88.1 T4.1 U17.2(-VIN) V1.2 ; port GNDPDIN  [also labelled VIN-(IN)]
VIN+: C21.2 C28.2 K2.5 U18.1(IP+) U18.2(IP+)
S-Current: C20.2 R84.1 R86.1 ; port S-Current
VDDPD: K2.2 ; port VDDPD
VIN+(ACS): C24.2 F1.2(OUT) U18.3(IP-) U18.4(IP-) V1.1
NetC16_2: C16.2 U18.6(Filter)
NetC29_1: C29.1 U19.4(BYPASS)
NetD2_A: D2.A T4.2
NetD2_K: D2.K F1.1(IN)
NetD3_K: D3.K I1.1 U20.2(OUT)
NetD4_A: D4.A R91.2 Sc1.S
NetD5_A: D5.A K2.4 Q3.3(C)
NetDS1_A: DS1.A R83.2
NetQ2_1: Q2.1(B) R87.1 R88.2
NetQ2_3: Q2.3(C) U17.3(R_On/Off)
NetQ3_1: Q3.1(B) R89.1 R90.2
NetR84_2: R84.2 U18.7(Vout)
NetR85_W: R85.W U17.6(TRIM)
NetR87_2: R87.2 ; port Re_MX
NetR89_2: R89.2 ; port Re_M

Not connected (* = marked no-connect by the designer): K2 3*; R85 CCW(-)*; Sc2 S; Sc3 S; Sc4 S; U17 1(+VIN)

### Notes on the sheet
- Title
- Size:
- Data:
- CompanyName:
- A4
- Number:
- Time:
- Revision:
- Engineer:
- File:
- (in symbol Fuse) FUSE
- (in symbol LM2576S) PMLIB
- (in symbol MK50) MKW50; P.MLIB

### Library data of the parts
C16-C20 C22 C29 = Cap: Surface mount Capacitor
C21 C23-C28 C30 C31 = Cap_P: Polarity
D2 D3 = Diode
F1 = Fuse
I1 I2 = Inductor: Indicator
Q2 Q3 = NPN: NPN Bipolar Transistor; Published: 8-Jun-2000; LatestRevisionDate: 29-May-2009; LatestRevisionNote: IPC-7351 Footprint Added.; PackageVersion: Aug-1999; PackageReference: SOT-23B; Publisher: Altium Limited; PackageDescription: 3-Pin SOT-23 Package 0.95 mm Pitch, 2.4 mm Lead Span
R85 = RPot SM: Square Trimming Potentiometer; Published: 17-Dec-2003; DatasheetVersion: Oct-2003; PackageReference: POT4MM-2; Publisher: Altium Limited; PackageDescription: Square Trimming Potentiometer; ComponentLink1Description: Manufacturer Link; ComponentLink1URL: http://bourns.com/2/search.html
R87 R88 = Resistor
Sc1-Sc4 = Screw: Screw 3mm
T4 = ATX_1.2R: Connector
U17 = MK50: DCtoDC
U18 = ACS712: Hall effect Current Sensor
U19 = LD3985M33R: Linear Voltage Regulator IC 1 Output 150mA
U20 = LM2576S: Regulator
U21 = PJ1117_3.3V: Regulator
V1 = MOV-07D: 07D181K = 26V

## Sheet MicroControllerSTM32f107VCT.SchDoc
size A4
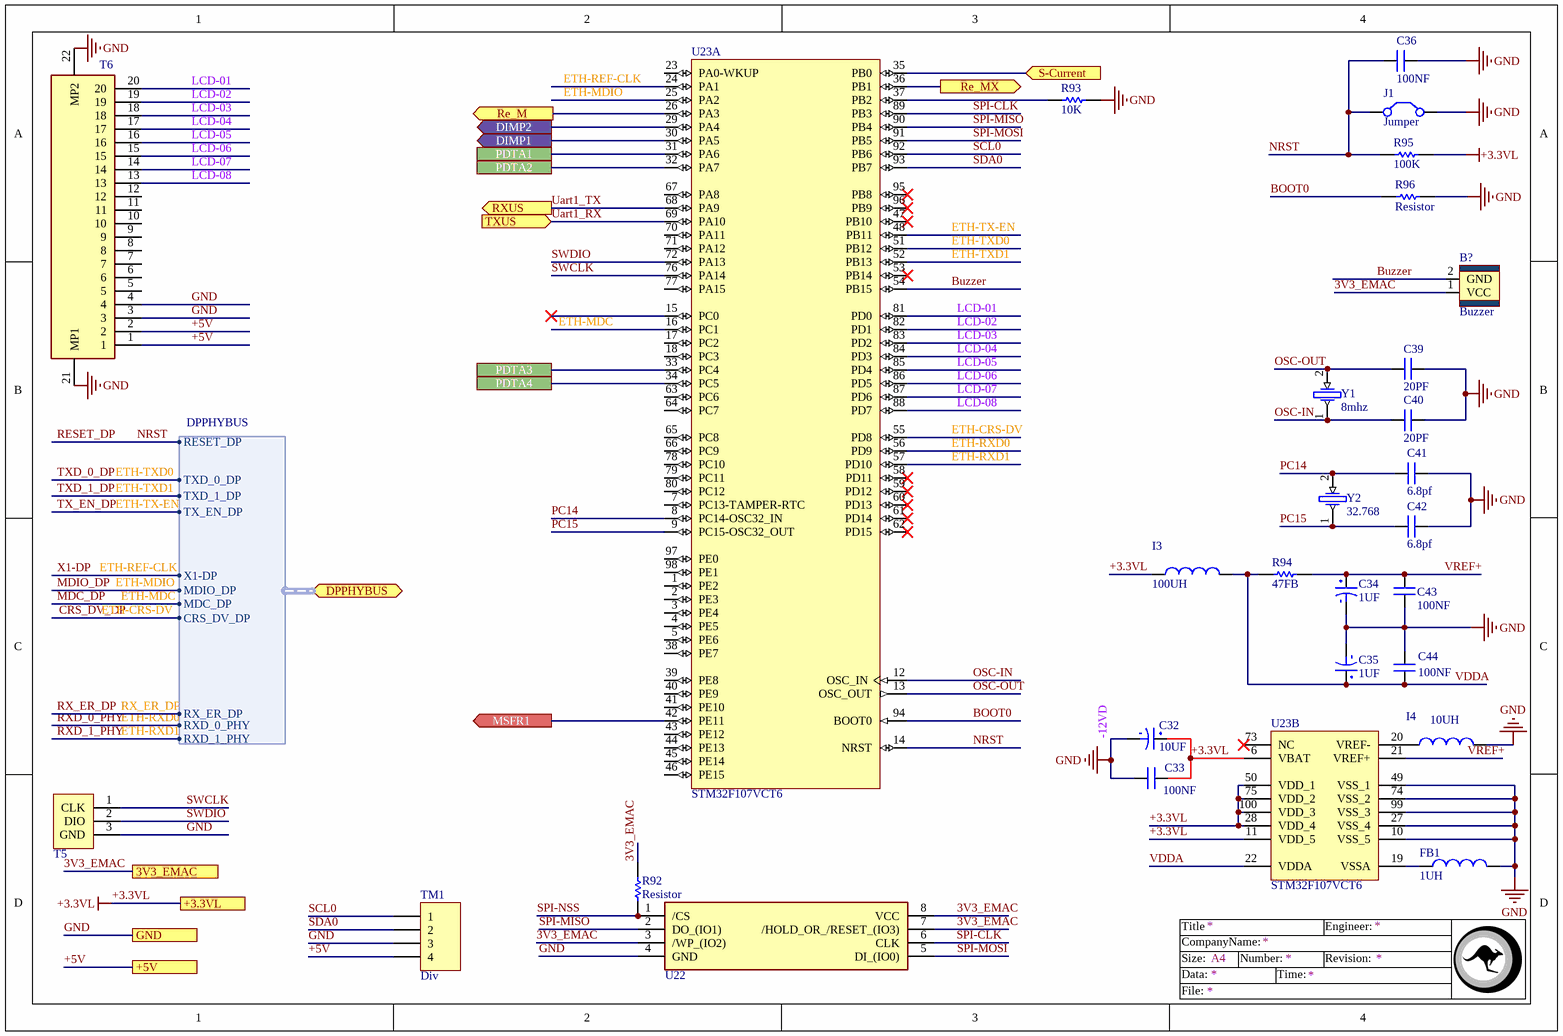
[diagram p4: MicroControllerSTM32f107VCT.SchDoc]

### Parts
B?  Buzzer  [Buzzer]
C32  10UF  [CAPMOL_B]
C33  100NF  [Cap0805]
C34  1UF  [CAPMOL_B]
C35  1UF  [CAPMOL_B]
C36  100NF  [Cap0805]
C39  20PF  [Cap0805]
C40  20PF  [Cap0805]
C41  6.8pf  [Cap0805]
C42  6.8pf  [Cap0805]
C43  100NF  [Cap0805]
C44  100NF  [Cap0805]
FB1  1UH  [1206]
I3  100UH  [1206]
I4  10UH  [1206]
J1  Jumper  [Jumper SMD - Small]
R92  Resistor  [0603]
R93  10K  [R0805]
R94  47FB  [R0805]
R95  100K  [R0805]
R96  Resistor  [R0805]
T5  Serial Program  [MHDR1X03-254P - E]  (value not drawn)
T6  FFC 20PIN 0.5MM  [FFC/SM0.5-20PIN]  (value not drawn)
TM1  Div  [SPOX_1*4RIGHT]
U22  W25Q32FV  [SOIC127P790X216-8N]  (value not drawn)
U23  STM32F107VCT6  [LQFP100_L]  (parts A,B of 2)
Y1  8mhz  [CrystallB]
Y2  32.768  [XTAL RTC]

### Ports
3V3_EMAC, +3.3VL, +5V, DIMP1 (out), DIMP2 (out), DPPHYBUS (bidir, harness DPPHYBUS), GND, MSFR1 (out), PDTA1, PDTA2, PDTA3, PDTA4, Re_M (out), Re_MX (out), RXUS (out), S-Current (in), TXUS (in)

### Harnesses
DPPHYBUS: RESET_DP, TXD_0_DP, X1-DP, TXD_1_DP, TX_EN_DP, MDIO_DP, MDC_DP, CRS_DV_DP, RX_ER_DP, RXD_0_PHY, RXD_1_PHY

### Nets
3V3_EMAC: B?.1(VCC) R92.1 U22.3(/WP_(IO2)) U22.7(/HOLD_OR_/RESET_(IO3)) U22.8(VCC) ; port 3V3_EMAC
+3.3VL: C32.2 C33.1 I3.1 R95.1 U23.6(VBAT) U23.11(VDD_5) U23.28(VDD_4) U23.50(VDD_1) U23.75(VDD_2) U23.100(VDD_3) ; port +3.3VL
+5V: T6.1 T6.2 TM1.4 ; port +5V
-12VD: C32.1 C33.2 C34.1 C35.1 C36.2 C39.2 C40.2 C41.2 C42.2 C43.1 C44.2 FB1.2 I4.2 J1.2(C2) R93.1 R96.1 T5.3(GND) T6.3 T6.4 T6.21(MP1) T6.22(MP2) TM1.3 U22.4(GND) U23.10(VSS_5) U23.27(VSS_4) U23.49(VSS_1) U23.74(VSS_2) U23.99(VSS_3) ; port GND  [also labelled GND]
BOOT0: R96.2 U23.94(BOOT0)
Buzzer: B?.2(GND) U23.54(PB15)
CRS_DV_DP: U23.55(PD8) ; port DPPHYBUS.CRS_DV_DP  [also labelled ETH-CRS-DV]
ETH-MDC: U23.16(PC1) ; port DPPHYBUS.MDC_DP  [also labelled MDC_DP]
ETH-MDIO: U23.25(PA2) ; port DPPHYBUS.MDIO_DP  [also labelled MDIO_DP]
ETH-REF-CLK: U23.24(PA1) ; port DPPHYBUS.X1-DP  [also labelled X1-DP]
ETH-RXD0: U23.56(PD9) ; port DPPHYBUS.RXD_0_PHY  [also labelled RXD_0_PHY]
ETH-RXD1: U23.57(PD10) ; port DPPHYBUS.RXD_1_PHY  [also labelled RXD_1_PHY]
ETH-TX-EN: U23.48(PB11) ; port DPPHYBUS.TX_EN_DP  [also labelled TX_EN_DP]
ETH-TXD0: U23.51(PB12) ; port DPPHYBUS.TXD_0_DP  [also labelled TXD_0_DP]
ETH-TXD1: U23.52(PB13) ; port DPPHYBUS.TXD_1_DP  [also labelled TXD_1_DP]
LCD-01: T6.20 U23.81(PD0)
LCD-02: T6.19 U23.82(PD1)
LCD-03: T6.18 U23.83(PD2)
LCD-04: T6.17 U23.84(PD3)
LCD-05: T6.16 U23.85(PD4)
LCD-06: T6.15 U23.86(PD5)
LCD-07: T6.14 U23.87(PD6)
LCD-08: T6.13 U23.88(PD7)
NRST: C36.1 J1.1(C1) R95.2 U23.14(NRST) ; port DPPHYBUS.RESET_DP  [also labelled RESET_DP]
OSC-IN: C40.1 U23.12(OSC_IN) Y1.1
OSC-OUT: C39.1 U23.13(OSC_OUT) Y1.2
PC14: C41.1 U23.8(PC14-OSC32_IN) Y2.2
PC15: C42.1 U23.9(PC15-OSC32_OUT) Y2.1
S-Current: U23.35(PB0) ; port S-Current
SCL0: TM1.1 U23.92(PB6)
SDA0: TM1.2 U23.93(PB7)
SPI-CLK: U22.6(CLK) U23.89(PB3)
SPI-MISO: U22.2(DO_(IO1)) U23.90(PB4)
SPI-MOSI: U22.5(DI_(IO0)) U23.91(PB5)
SPI-NSS: R92.2 U22.1(/CS)
SWCLK: T5.1(CLK) U23.76(PA14)
SWDIO: T5.2(DIO) U23.72(PA13)
Uart1_RX: U23.69(PA10) ; port TXUS  [project net TXUS]
Uart1_TX: U23.68(PA9) ; port RXUS  [project net RXUS]
VDDA: C35.2 C44.1 I3.2 R94.2 U23.22(VDDA)
VREF+: C34.2 C43.2 R94.1 U23.21(VREF+)
NetFB1_1: FB1.1 U23.19(VSSA)
NetI4_1: I4.1 U23.20(VREF-)
NetK1_3: U23.29(PA4) ; port DIMP2
NetK1_6: U23.30(PA5) ; port DIMP1
NetR26_1: U23.42(PE11) ; port MSFR1
NetR27_1: U23.31(PA6) ; port PDTA1
NetR28_1: U23.32(PA7) ; port PDTA2
NetR68_1: U23.33(PC4) ; port PDTA3
NetR69_1: U23.34(PC5) ; port PDTA4
NetR87_2: U23.36(PB1) ; port Re_MX
NetR89_2: U23.26(PA3) ; port Re_M
NetR93_2: R93.2 U23.37(PB2)

Not connected (* = marked no-connect by the designer): T6 5 6 7 8 9 10 11 12; U23 1(PE2) 2(PE3) 3(PE4) 4(PE5) 5(PE6) 7(PC13-TAMPER-RTC) 15(PC0)* 17(PC2) 18(PC3) 23(PA0-WKUP) 38(PE7) 39(PE8) 40(PE9) 41(PE10) 43(PE12) 44(PE13) 45(PE14) 46(PE15) 47(PB10)* 53(PB14)* 58(PD11)* 59(PD12)* 60(PD13)* 61(PD14)* 62(PD15)* 63(PC6) 64(PC7) 65(PC8) 66(PC9) 67(PA8) 70(PA11) 71(PA12) 73(NC)* 77(PA15) 78(PC10) 79(PC11) 80(PC12) 95(PB8)* 96(PB9)* 97(PE0) 98(PE1)

### Notes on the sheet
- Title
- Size:
- Data:
- CompanyName:
- A4
- Number:
- Time:
- Revision:
- Engineer:
- File:

### Library data of the parts
C32 C34 C35 = Cap_P: Polarity
C33 C36 C39-C44 = Cap: Surface mount Capacitor
FB1 I3 I4 = Inductor: Indicator
R93 R95 = Resistor
R94 = Resistor: FB
T5 = Serial Program: STM Serial Program pin
T6 = FFC 20PIN 0.5MM: LCD
TM1 = SPOX 1*4: SPOX1*4
U22 = W25Q32FV: 32M-BIT / SERIAL FLASH MEMORY
U23 = STM32F107VCT6: STM32 ARM-based 32-bit MCU Connectivity Line & Ethernet with 256 kB Flash, 64 kB Internal RAM, -40 to +85°C Temperature, 100-Pin LQFP, Tray; DatasheetVersion: rev5.0, May-2010; PackageVersion: rev13, Apr-2011; PackageReference: LQFP100; PackageDescription: 100-Pin Low-Profile Quad Flat Pack, 14 x 14 mm Body, 0.5 mm Pitch (LQFP100); ComponentLink1Description: Manufacturer URL; ComponentLink1URL: http://www.st.com/; ComponentLink2Description: STM32F105/107 Datasheet; ComponentLink2URL: http://www.st.com/internet/com/TECHNICAL_RESOURCES/TECHNICAL_LITERATURE/DATASHEET/CD00220364.pdf; ComponentLink3Description: STM32 Family Web Page; ComponentLink3URL: www.st.com/stm32
Y1 Y2 = Crystal

## Nets that join several sheets
3V3_EMAC: Communication Ethernet DP (23 pins), Power Management (7 pins), MicroControllerSTM32f107VCT (5 pins)
+3.3VL: Power Management (C22.2 U19.5), MicroControllerSTM32f107VCT (10 pins)
+5V: Analogue (6 pins), Communication USB - FT232 (6 pins), Power Management (12 pins), MicroControllerSTM32f107VCT (T6.1 T6.2 TM1.4)
+12V: Analogue (18 pins), Power Management (U17.4 U20.1)
-12VD: Communication Ethernet DP (16 pins), Analogue (47 pins), Communication USB - FT232 (12 pins), Power Management (28 pins), MicroControllerSTM32f107VCT (28 pins)
CRS_DV_DP: Communication Ethernet DP (R98.1 U24.40), MicroControllerSTM32f107VCT (U23.55)
ETH-MDC: Communication Ethernet DP (U24.31), MicroControllerSTM32f107VCT (U23.16)
ETH-MDIO: Communication Ethernet DP (U24.30), MicroControllerSTM32f107VCT (U23.25)
ETH-REF-CLK: Communication Ethernet DP (U24.34 Y3.3), MicroControllerSTM32f107VCT (U23.24)
ETH-RXD0: Communication Ethernet DP (U24.43), MicroControllerSTM32f107VCT (U23.56)
ETH-RXD1: Communication Ethernet DP (U24.44), MicroControllerSTM32f107VCT (U23.57)
ETH-TX-EN: Communication Ethernet DP (U24.2), MicroControllerSTM32f107VCT (U23.48)
ETH-TXD0: Communication Ethernet DP (U24.3), MicroControllerSTM32f107VCT (U23.51)
ETH-TXD1: Communication Ethernet DP (U24.4), MicroControllerSTM32f107VCT (U23.52)
NetK1_3: Analogue (K1.3), MicroControllerSTM32f107VCT (U23.29)
NetK1_6: Analogue (K1.6), MicroControllerSTM32f107VCT (U23.30)
NetR26_1: Analogue (R26.1), MicroControllerSTM32f107VCT (U23.42)
NetR27_1: Analogue (R27.1 U1.7), MicroControllerSTM32f107VCT (U23.31)
NetR28_1: Analogue (R28.1 U2.7), MicroControllerSTM32f107VCT (U23.32)
NetR68_1: Analogue (R68.1 U8.7), MicroControllerSTM32f107VCT (U23.33)
NetR69_1: Analogue (R69.1 U9.7), MicroControllerSTM32f107VCT (U23.34)
NetR87_2: Power Management (R87.2), MicroControllerSTM32f107VCT (U23.36)
NetR89_2: Power Management (R89.2), MicroControllerSTM32f107VCT (U23.26)
NRST: Communication Ethernet DP (U24.29), MicroControllerSTM32f107VCT (C36.1 J1.1 R95.2 U23.14)
RXUS: Communication USB - FT232 (R115.2 R119.2), MicroControllerSTM32f107VCT (U23.68)
S-Current: Power Management (C20.2 R84.1 R86.1), MicroControllerSTM32f107VCT (U23.35)
TXUS: Communication USB - FT232 (R114.2 R118.1), MicroControllerSTM32f107VCT (U23.69)
VDDPD: Analogue (9 pins), Power Management (K2.2)